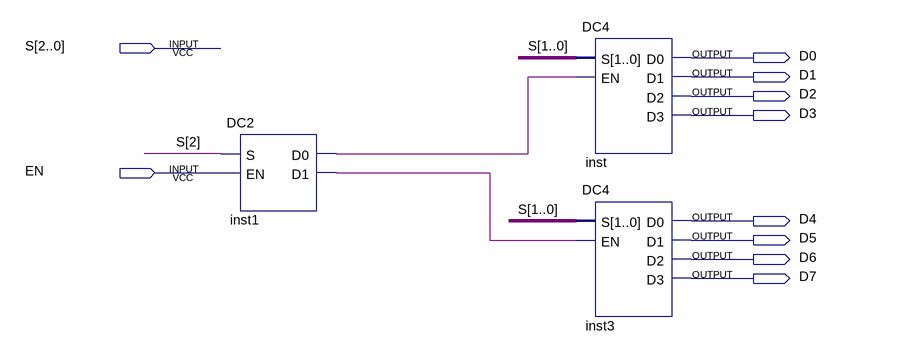
[diagram p0: schematic sheet]
// Quartus schematic DC8.bdf as structural Verilog: 3 symbols, 10 pins
module DC8 (
  input  [2:0] S,
  input  EN,
  output D0,
  output D1,
  output D2,
  output D3,
  output D4,
  output D5,
  output D6,
  output D7
);

  wire inst1_d0, inst1_d1;

  DC2 inst1 (.S(S[2]), .EN(EN), .D0(inst1_d0), .D1(inst1_d1));
  DC4 inst (.S(S[1:0]), .EN(inst1_d0), .D0(D0), .D1(D1), .D2(D2), .D3(D3));
  DC4 inst3 (.S(S[1:0]), .EN(inst1_d1), .D0(D4), .D1(D5), .D2(D6), .D3(D7));
endmodule
